# Altium schematic sheet CWStage.SchDoc
size A
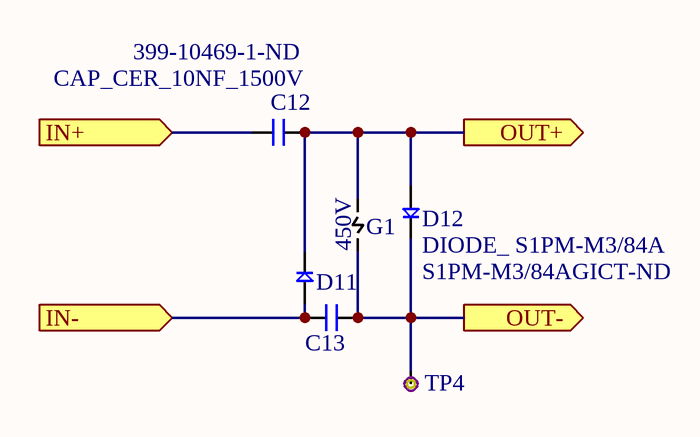
[diagram p0: CWStage.SchDoc]

## Parts
C12  CAP_CER_10NF_1500V  Supplier Part Number 1: 399-10469-1-ND  [C1206]
C13  CAP_CER_10NF_1500V  [C1206]  (value not drawn)
D11  DIODE_ S1PM-M3/84A  [DO-220AA]  (value not drawn)
D12  DIODE_ S1PM-M3/84A  Supplier Part Number 1: S1PM-M3/84AGICT-ND  [DO-220AA]
G1  450V  [SPARK_GAP_450V]
TP4  TEST_POINT_PURPLE_KEYSTONE_5119  [TEST_POINT_KEYSTONE_5119]  (value not drawn)

## Ports
IN+ (in), IN- (in), OUT+ (out), OUT- (out)

## Nets
IN+: C12.1 ; port IN+
IN-: C13.1 D11.2 ; port IN-
OUT+: C12.2 D11.1 D12.2 G1.2 ; port OUT+
OUT-: C13.2 D12.1 G1.1 TP4.1 ; port OUT-

## Library data of the parts
G1 = SPARK_GAP_450V
TP4 = TEST_POINT_PURPLE_KEYSTONE_5119: PURPLE T/H TEST POINT; Manufacturer: Keystone Electronics; Manufacturer Part Number: 5119; Plating: Silver; Material - Insulation: Nylon 46, UL 94V-0; Material - Body: Phosphor Bronze; Supplier 1: Digi-Key; RoHS: RoHS Compliant; Category: Test and Measurement; Stock 1: 19346; Pricing 1: 1=0.37, 10=0.316, 50=0.2298, 100=0.2209, 250=0.19832, 500=0.18932, 1000=0.1616, 2500=0.14424, 5000=0.13523 (USD); Packaging: Bulk; Part Status: Active; Type: PC Test Point, Miniature; Mounting Type: 0.040" (1.02mm) Hole Diameter; Color: Purple; Size / Dimension: 0.100" Dia x 0.180" L (2.54mm x 4.57mm); ComponentLink1URL: http://www.keyelco.com/product-pdf.cfm?p=1338; ComponentLink1Description: http://www.keyelco.com/product-pdf.cfm?p=1338; Supplier Part Number 1: 36-5119-ND
C12 C13 = CAP_CER_10NF_1500V: Supplier 1: Digi-Key
  C13: Supplier Part Number 1: 399-10469-1-ND
D11 D12 = DIODE_ S1PM-M3/84A: Supplier 1: Digi-Key
  D11: Supplier Part Number 1: S1PM-M3/84AGICT-ND